# Altium schematic sheet Transmitter.SchDoc
size A
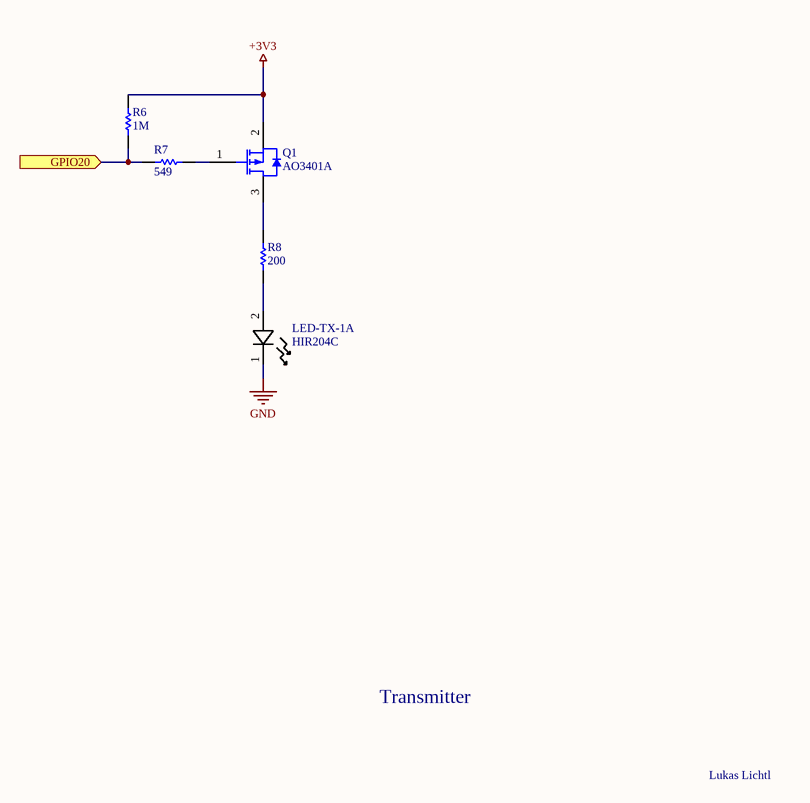
[diagram p0: Transmitter.SchDoc]

## Parts
LED-TX-1  HIR204C  [LED_RADIAL_HIR204C]  (part A of 4)
Q1  AO3401A  [AO-SOT-23-3L_V]
R6  1M  [RESC1608X55X25NL10T15]
R7  549  [RESC1608X55X25NL10T15]
R8  200  [RESC1608X55X25NL10T15]

## Ports
GPIO20 (in)

## Nets
+3V3: Q1.2(SOURCE) R6.2
GND: LED-TX-1.1(CAHTODE)
GPIO20: R6.1 R7.1 ; port GPIO20
NetLED-TX-1_2: LED-TX-1.2(ANODE) R8.1
NetQ1_1: Q1.1(GATE) R7.2
NetQ1_3: Q1.3(DRAIN) R8.2

## Notes on the sheet
- Transmitter
- Lukas Lichtl

## Library data of the parts
LED-TX-1 = HIR204C: Description; Manufacturer_Name: Everlight; Type: LED Indication; Copyright: Copyright (C) 2025 Ultra Librarian. All rights reserved.; Manufacturer_Part_Number: HIR204C
Q1 = CMP-2000-05778-1: P-Channel MOSFET, 30 V, 4 A, -55 to 150 degC, 3-Pin SOT-23-3L, RoHS, Tape and Reel; Manufacturer: Alpha and Omega; Output Power (Max): NotRequiredW; Power Dissipation: 1.4W; Rad Hardened: No; Drain Efficiency: NotRequired%; Drain-Source On-Volt: 30V; Noise Figure: NotRequireddB; Frequency (Max): NotRequiredMHz; Number of  Elements: 1; Gate-Source Voltage (Max): ?12V; Drain Current (Max): 4A; Channel Mode: Enhancement; Drain-Source On-Res: 0.044ohm; Type: PowerMOSFET; Polarity: P; Package URL: http://www.aosmd.com/res/packaging_information/SOT-23-3L.pdf; Datasheet URL: http://www.aosmd.com/res/data_sheets/AO3401A.pdf; Package Type: SOT-23; Package Description: 3-Pin Small Outline Transistor, Body 2.95 x 1.6 mm, Pitch 0.95 mm; Mounting: SurfaceMount; Manufacturer URL: http://www.aosmd.com/; Continuous Drain Current: 4A; Package Reference: SOT-23-3L; Mounting Technology: SurfaceMount; Operating Temperature Classification: Military; Power Gain: NotRequireddB; Datasheet Version: Rev. 3, 03/2011; Operating Temp Range: -55Cto150C; Pin Count: 3
R6-R8 = CMP-2000-04082-1: Manufacturer: Yageo; Part Number: RC0603FR-07549RL